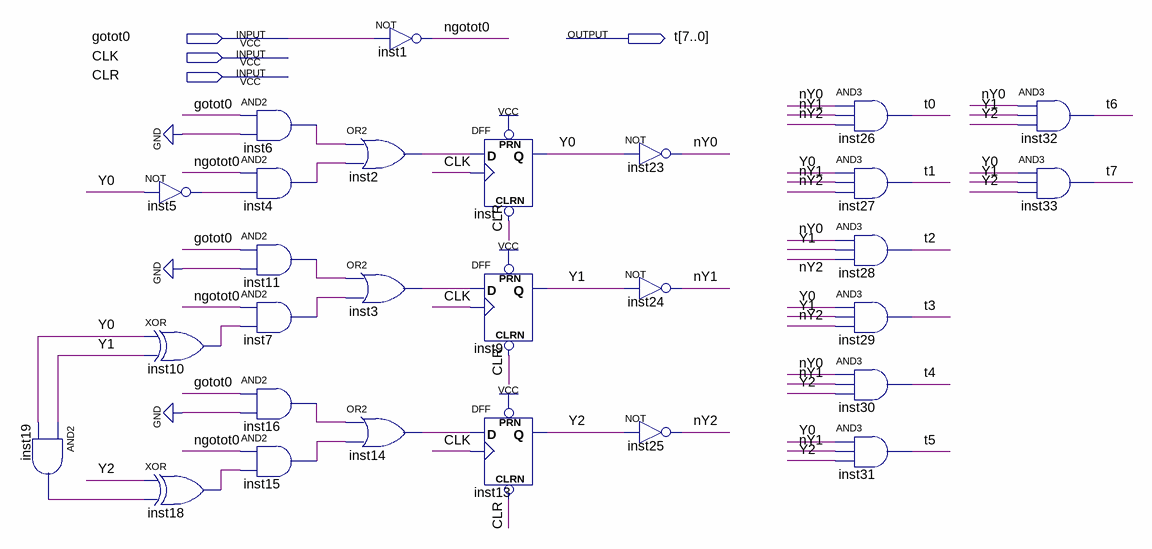
[diagram p0: schematic sheet]
// Quartus schematic Temporizador.bdf as structural Verilog: 28 symbols, 4 pins
module Temporizador (
  input  gotot0,
  input  CLK,
  input  CLR,
  output [7:0] t
);

  wire inst2_out, inst3_out, inst4_out, inst5_out, inst6_out, inst7_out, inst10_out, inst11_out, inst14_out,
       inst15_out, inst16_out, inst18_out, inst19_out, ngotot0, nY0, nY1, nY2, Y0, Y1, Y2;

  and inst19 (inst19_out, Y1, Y0);
  not inst5 (inst5_out, Y0);
  xor inst10 (inst10_out, Y0, Y1);
  xor inst18 (inst18_out, Y2, inst19_out);
  and inst6 (inst6_out, gotot0, 1'b0);
  and inst4 (inst4_out, ngotot0, inst5_out);
  and inst11 (inst11_out, gotot0, 1'b0);
  and inst7 (inst7_out, ngotot0, inst10_out);
  and inst16 (inst16_out, gotot0, 1'b0);
  and inst15 (inst15_out, ngotot0, inst18_out);
  or inst2 (inst2_out, inst6_out, inst4_out);
  or inst3 (inst3_out, inst11_out, inst7_out);
  or inst14 (inst14_out, inst16_out, inst15_out);
  not inst1 (ngotot0, gotot0);
  DFF inst (.CLRN(CLR), .CLK(CLK), .D(inst2_out), .PRN(1'b1), .Q(Y0));
  DFF inst9 (.CLRN(CLR), .CLK(CLK), .D(inst3_out), .PRN(1'b1), .Q(Y1));
  DFF inst13 (.CLRN(CLR), .CLK(CLK), .D(inst14_out), .PRN(1'b1), .Q(Y2));
  not inst23 (nY0, Y0);
  not inst24 (nY1, Y1);
  not inst25 (nY2, Y2);
  and inst26 (t[0], nY0, nY1, nY2);
  and inst27 (t[1], Y0, nY1, nY2);
  and inst28 (t[2], nY0, Y1, nY2);
  and inst29 (t[3], Y0, Y1, nY2);
  and inst30 (t[4], nY0, nY1, Y2);
  and inst31 (t[5], Y0, nY1, Y2);
  and inst32 (t[6], nY0, Y1, Y2);
  and inst33 (t[7], Y0, Y1, Y2);
endmodule
